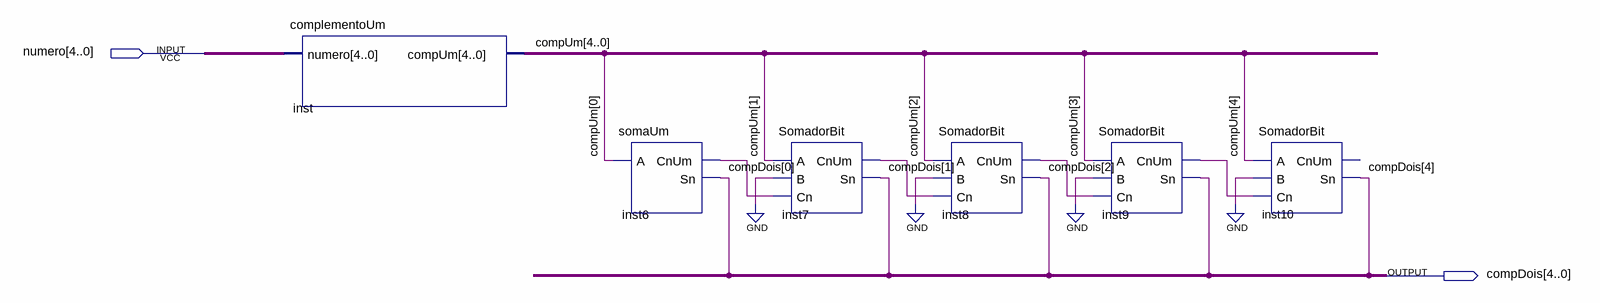
[diagram p0: schematic sheet]
// Quartus schematic complementoDois.bdf as structural Verilog: 6 symbols, 2 pins
module complementoDois (
  input  [4:0] numero,
  output [4:0] compDois
);

  wire inst6_cnum, inst7_cnum, inst8_cnum, inst9_cnum, inst9_sn;
  wire [4:0] compUm;

  complementoUm inst (.numero(numero), .compUm(compUm));
  somaUm inst6 (.A(compUm[0]), .CnUm(inst6_cnum), .Sn(compDois[0]));
  SomadorBit inst7 (.A(compUm[1]), .B(1'b0), .Cn(inst6_cnum), .CnUm(inst7_cnum), .Sn(compDois[1]));
  SomadorBit inst8 (.A(compUm[2]), .B(1'b0), .Cn(inst7_cnum), .CnUm(inst8_cnum), .Sn(compDois[2]));
  SomadorBit inst9 (.A(compUm[3]), .B(1'b0), .Cn(inst8_cnum), .CnUm(inst9_cnum), .Sn(inst9_sn));
  SomadorBit inst10 (.A(compUm[4]), .B(1'b0), .Cn(inst9_cnum), .Sn(compDois[4]));  // open: CnUm
endmodule
